# EAGLE design ng-beacon (EAGLE 7.6.0)
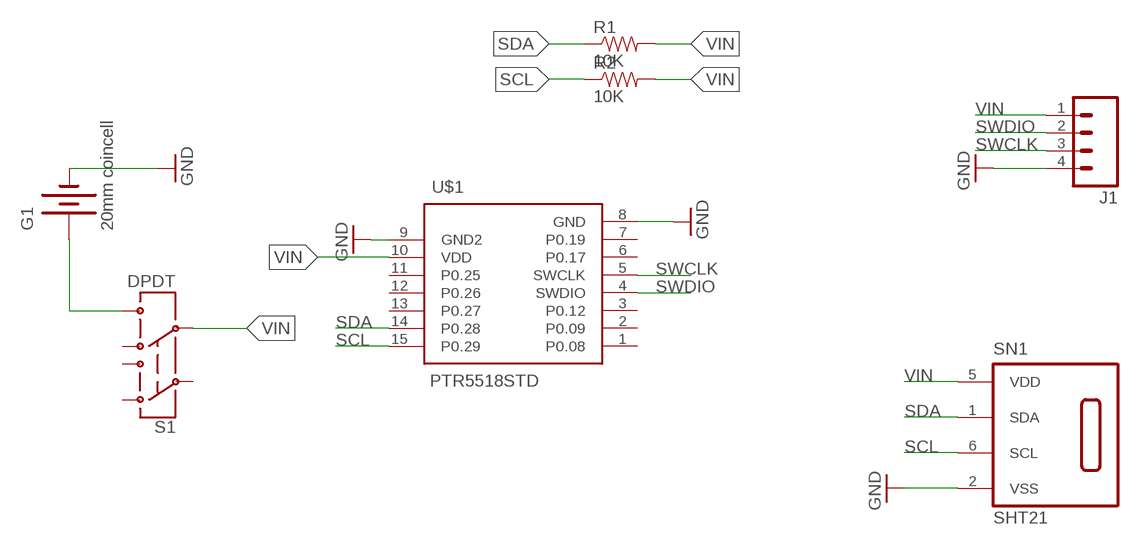
[diagram p0: schematic, sheet 1]

## Parts
G1  20mm coincell  BATTERY20MM_4LEGS  [BATTCON_20MM_4LEGS]
J1  M04LOCK  [1X04_LOCK]
R1  10K  10KOHM-1/10W-1%(0603)0603  [0603-RES]
R2  10K  10KOHM-1/10W-1%(0603)0603  [0603-RES]
S1  DPDT  SWITCH-DPDTAYZ0202  [AYZ0202]
SN1  SHT21  [DFN6/SHT]
U$1  PTR5518STD  [PTR5518]

## Nets
GND: G1.NEGATIVE(-) J1.4 SN1.2(VSS) U$1.8(GND) U$1.9(GND2)
N$1: G1.POSITIVE@1(+) G1.POSITIVE@2(+) G1.POSITIVE@3(+) G1.POSITIVE@4(+) S1.6
SCL: R2.1 SN1.6(SCL) U$1.15(P0.29)
SDA: R1.1 SN1.1(SDA) U$1.14(P0.28)
SWCLK: J1.3 U$1.5(SWCLK)
SWDIO: J1.2 U$1.4(SWDIO)
VIN: J1.1 R1.2 R2.2 S1.5 SN1.5(VDD) U$1.10(VDD)
Unconnected: S1.1 S1.2 S1.3 S1.4 U$1.1(P0.08) U$1.2(P0.09) U$1.3(P0.12) U$1.6(P0.17) U$1.7(P0.19) U$1.11(P0.25) U$1.12(P0.26) U$1.13(P0.27)

## Library data of the parts
G1 = SparkFun-Electromechanical:BATTERY: Battery Holders Various common sizes : AA, AAA, 18650 (PRT-12895), 20mm coin cell and 12mm coin cell. 20MM_4LEGS, BATT-10373; PROD_ID: BATT-10373
J1 = SparkFun-Connectors:M04: Header 4 Standard 4-pin 0.1" header. Use with straight break away headers (SKU : PRT-00116), right angle break away headers (PRT-00553), swiss pins (PRT-00743), machine pins (PRT-00117), and female headers (PRT-00115). Molex polarized connector foot print use with SKU : PRT-08231 with associated crimp pins and housings. 1MM SMD Version SKU: PRT-10208; PROD_ID: CONN-09696
R1 R2 = SparkFun-Resistors:10KOHM-1/10W-1%(0603): RES-00824; PROD_ID: RES-00824
S1 = SparkFun-Electromechanical:SWITCH-DPDT: DPDT Version of the COM-00597; PROD_ID: SWCH-08179
SN1 = sensirion:SHT21: Humidity and Temperature Sensor
U$1 = PTR5518:PTR5518: nRF51822-based breakout board

## Board
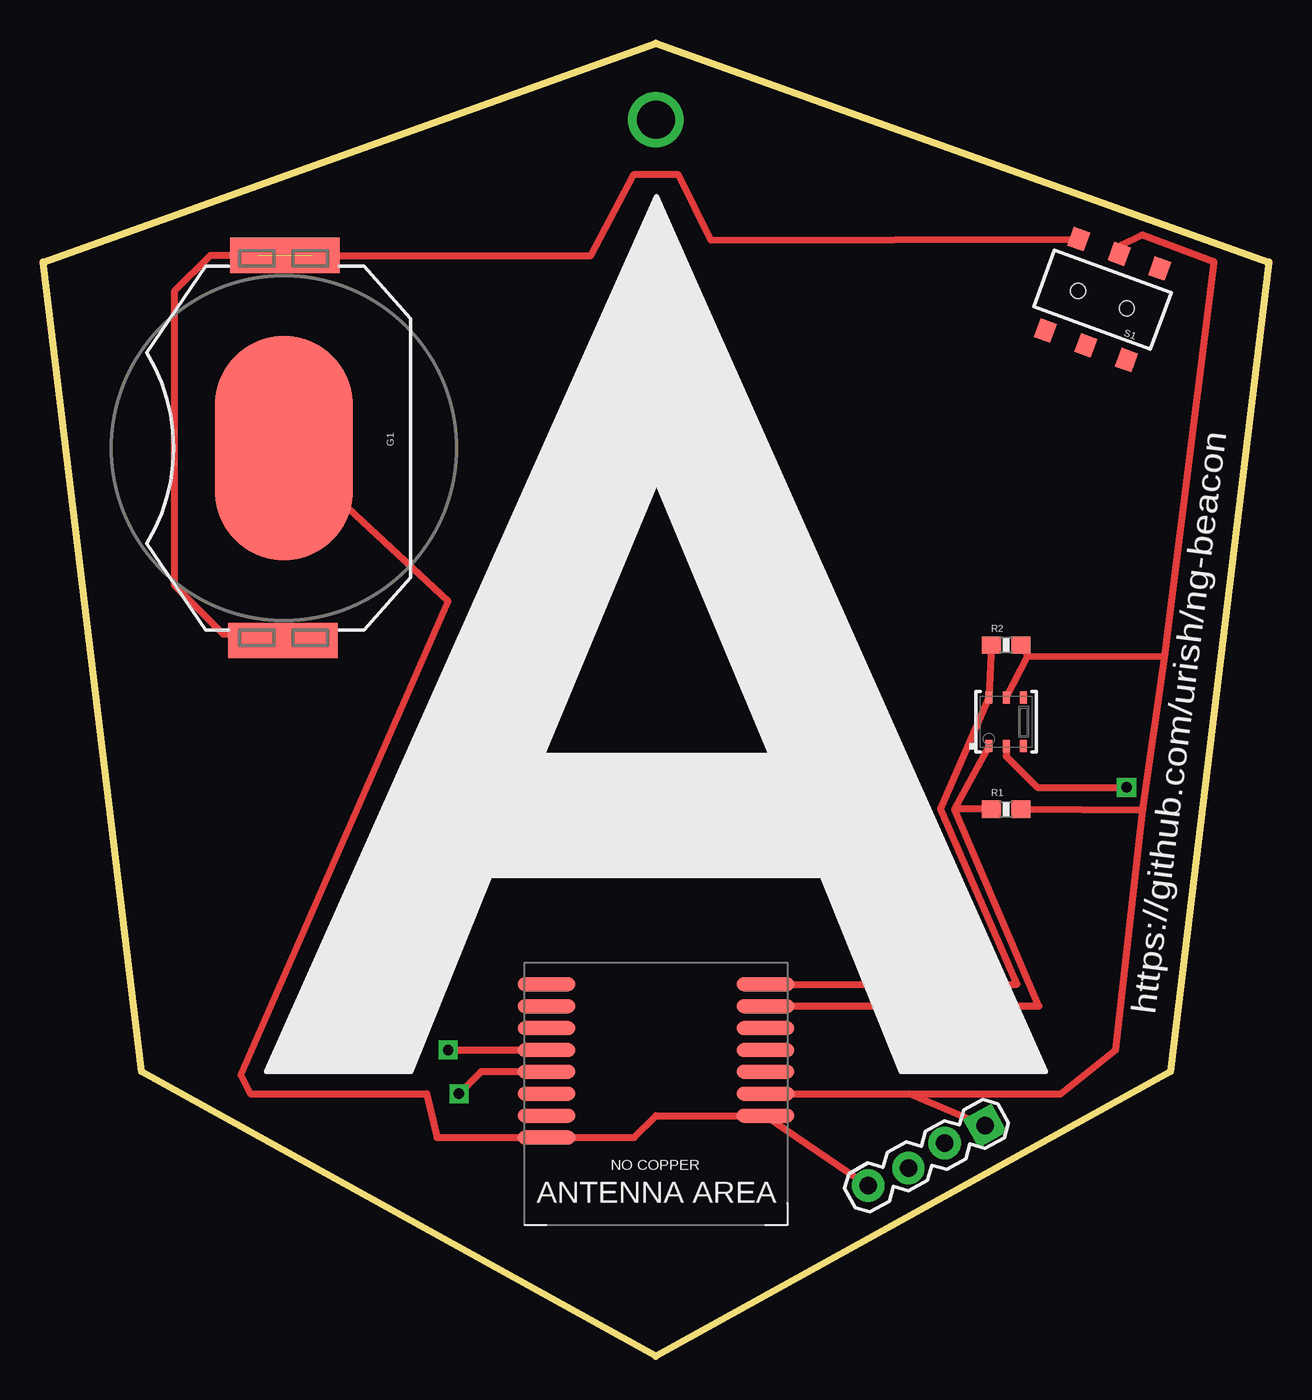
[diagram p1: board, top side]
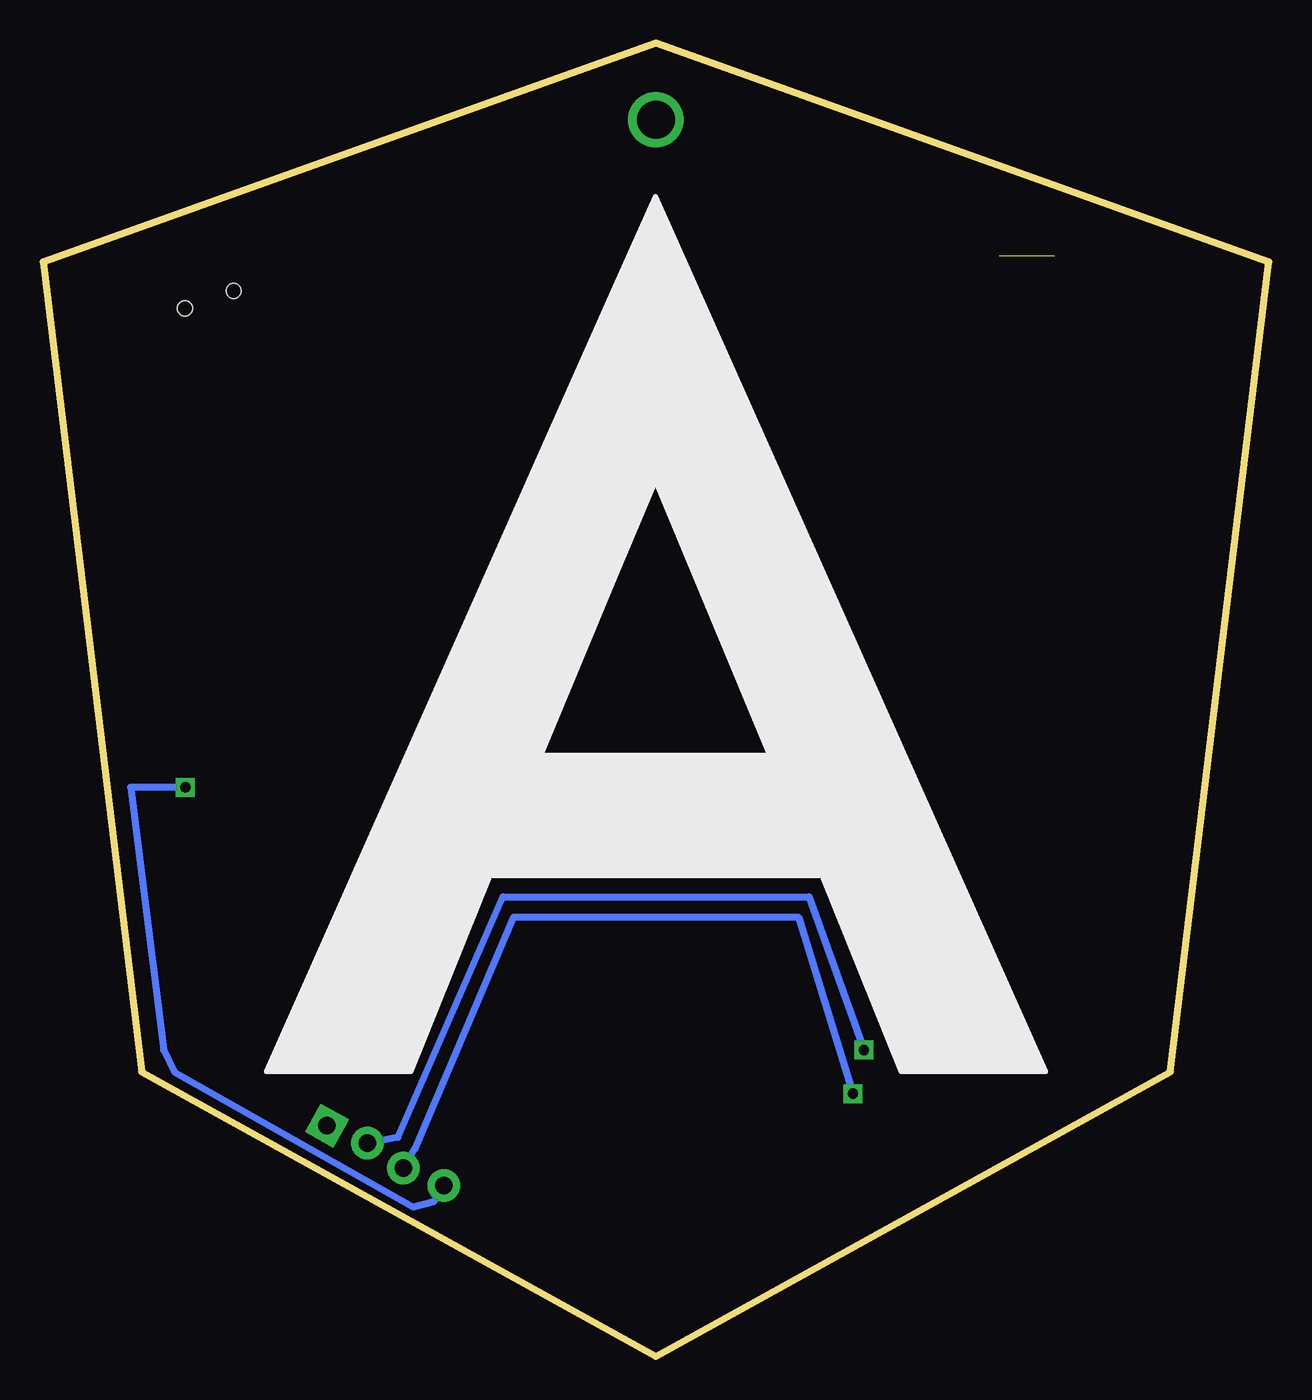
[diagram p2: board, bottom side, seen from below]

Size 71.12 x 76.2 mm. Coordinates in mm from the lower left corner, seen from the top.
Outline: 0,63.5 35.56,76.2 71.12,63.5 65.41,16.51 35.56,0 5.71,16.51 0,63.5
Copper layers (1*16): Top 0.035mm / dielectric 1.5mm / Bottom 0.035mm
Design rules "SparkFun-2-layer-STANDARD *": minimum track width 10mil, minimum drill 20mil, track to track 10mil, track to pad 8mil, pad to pad 8mil, via to via 10mil, smd to smd 8mil, copper to edge 8mil, drill to drill 8mil, minimum pad ring 10mil, minimum via ring 10mil, stop-mask expansion 4mil, vias tented up to drill 25mil, thermal gap 10mil

### Footprints (pad centres in the part's own frame; a part is rotated, then mirrored left to right if it is on the bottom)
BATTCON_20MM_4LEGS = smd 13 x 8: NEGATIVE 0,0 | smd 2.032 x 3.175: POSITIVE@1 -11.176,1.651; POSITIVE@2 -11.176,-1.524; POSITIVE@3 11.176,1.524; POSITIVE@4 11.176,-1.651
1X04_LOCK = drill 1.016 pad 1.88 square: 1 0,0.127 | drill 1.016 pad 1.88: 2 2.54,-0.127; 3 5.08,0.127; 4 7.62,-0.127
0603-RES = smd 1.1 x 1: 1 -0.85,0; 2 0.85,0
AYZ0202 = smd 1 x 1.15: 1 -2.5,2.825; 2 0,2.825; 3 2.5,2.825; 4 -2.5,-2.825; 5 0,-2.825; 6 2.5,-2.825 | hole 0.85: 1.5,0; -1.5,0
DFN6/SHT = smd 0.4 x 0.7: 1 -1,-1.4; 2 0,-1.4; 3 1,-1.4; 4 1,1.4; 5 0,1.4; 6 -1,1.4
PTR5518 = smd 3.353 x 0.813: 1 6.35,-6.35; 2 6.35,-5.08; 3 6.35,-3.81; 4 6.35,-2.54; 5 6.35,-1.27; 6 6.35,0; 7 6.35,1.27; 8 6.35,2.54; 9 -6.35,1.27; 10 -6.35,0; 11 -6.35,-1.27; 12 -6.35,-2.54; 13 -6.35,-3.81; 14 -6.35,-5.08; 15 -6.35,-6.35

### Placement (x,y rotation side)
G1  13.97,52.71 270 top
J1  54.59,13.49 209 top
R1  55.88,31.75 0 top
R2  55.88,41.28 0 top
S1  61.47,61.32 160 top
SN1  55.88,36.83 0 top
U$1  35.56,15.24 180 top

### Tracks (layer width: path | path; a pad name or v marks a point on that pad's centre or on a via)
GND  (via drill 0.6)
  Top 0.406: G1.NEGATIVE 23.5,43.82 11.47,16.34 12.02,15.24 22.26,15.24 22.86,12.7 U$1.8 34.29,12.7 35.56,13.97 U$1.9 J1.4 | SN1.2 55.88,34.82 57.68,33.02 v62.87,33.02
  Bottom 0.406: v62.87,33.02 66.04,33.02 64.14,17.78 63.5,16.51 49.64,8.68 48.44,8.99 J1.4
N$1  (1 unrouted)
  Top 0.406: S1.6 38.73,64.77 36.83,68.58 34.29,68.58 31.79,63.88 G1.POSITIVE@1 9.7,63.88 7.62,61.8 7.62,44.75 10.46,41.91 12.07,41.91 12.07,41.28 12.7,41.28 | 12.7,41.28 12.7,41.91 12.32,41.91 G1.POSITIVE@4 | 12.7,41.28 15.49,41.28 G1.POSITIVE@3
N$3  (via drill 2.2)
  other vias: 35.56,71.75
SCL
  Top 0.406: R2.1 SN1.6 52.07,31.75 56.52,21.59 U$1.15
SDA
  Top 0.406: SN1.1 52.89,31.75 | 52.89,31.75 57.78,20.32 U$1.14 | R1.1 52.89,31.75
SWCLK  (via drill 0.6)
  Top 0.406: U$1.5 25.4,16.51 v24.13,15.24
  Bottom 0.406: J1.3 49.53,12.06 43.81,25.49 27.31,25.49 v24.13,15.24
SWDIO  (via drill 0.6)
  Top 0.406: v23.5,17.78 U$1.4
  Bottom 0.406: v23.5,17.78 26.67,26.67 44.45,26.67 50.54,12.7 J1.2
VIN
  Top 0.406: U$1.10 50.25,15.24 | 50.25,15.24 J1.1 | 50.25,15.24 59.06,15.24 62.23,17.78 63.81,31.71 | 63.81,31.71 65.08,40.6 | 65.08,40.6 67.95,63.5 63.77,65.07 62.59,64.48 S1.5 | SN1.5 57.15,40.64 | 57.15,40.64 65.08,40.6 | R1.2 63.81,31.71 | R2.2 57.15,40.64

### Text on the board
tNames: https://github.com/urish/ng-beacon